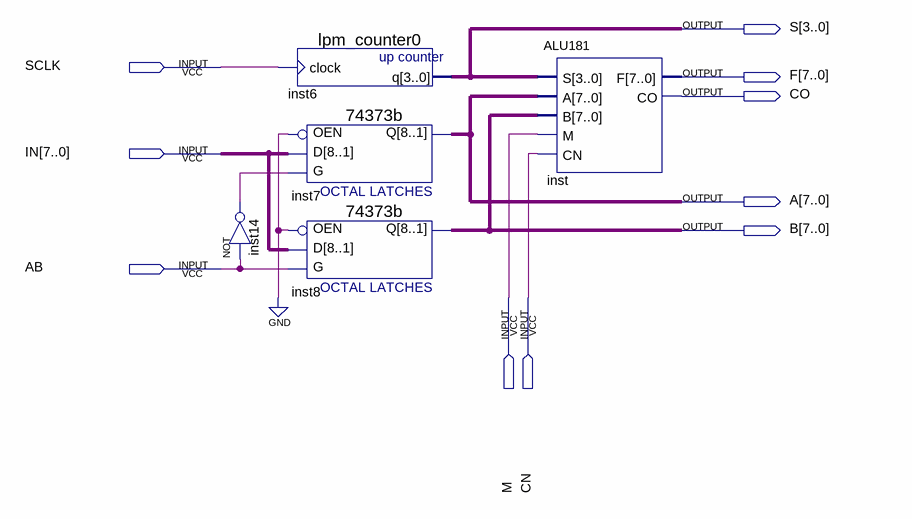
[diagram p0: schematic sheet]
// Quartus schematic lab2_alu.bdf as structural Verilog: 5 symbols, 10 pins
module lab2_alu (
  input  SCLK,
  input  [7:0] IN,
  input  AB,
  input  M,
  input  CN,
  output [3:0] S,
  output [7:0] F,
  output CO,
  output [7:0] A,
  output [7:0] B
);

  wire inst14_out;

  not inst14 (inst14_out, AB);
  lpm_counter0 inst6 (.clock(SCLK), .q(S));
  \74373b  inst7 (.D(IN), .G(inst14_out), .OEN(1'b0), .Q(A));
  \74373b  inst8 (.D(IN), .G(AB), .OEN(1'b0), .Q(B));
  ALU181 inst (.S(S), .A(A), .B(B), .M(M), .CN(CN), .F(F), .CO(CO));
endmodule
